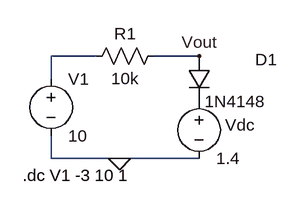
[diagram p0: schematic 9d.asc]
9d.asc, the LTspice schematic file:
Version 4
SHEET 1 880 680
WIRE 128 64 64 64
WIRE 272 64 208 64
WIRE 64 96 64 64
WIRE 64 208 64 176
WIRE 160 208 64 208
WIRE 272 208 160 208
FLAG 160 208 0
FLAG 272 64 Vout
SYMBOL voltage 64 80 R0
WINDOW 123 0 0 Left 0
WINDOW 39 0 0 Left 0
SYMATTR InstName V1
SYMATTR Value 10
SYMBOL voltage 272 112 R0
WINDOW 123 0 0 Left 0
WINDOW 39 0 0 Left 0
WINDOW 0 37 49 Left 2
SYMATTR InstName Vdc
SYMATTR Value 1.4
SYMBOL res 224 48 R90
WINDOW 0 0 56 VBottom 2
WINDOW 3 32 56 VTop 2
SYMATTR InstName R1
SYMATTR Value 10k
SYMBOL diode 256 64 R0
WINDOW 0 95 5 Left 2
SYMATTR InstName D1
SYMATTR Value 1N4148
TEXT 24 232 Left 2 !.dc V1 -3 10 1

The netlist it stands for:
* 9d.asc
V1 N001 0 10
Vdc P001 0 1.4
R1 Vout N001 10k
D1 Vout P001 1N4148
.model D D
.lib standard.dio
.dc V1 -3 10 1
.backanno
.end